# EAGLE design meduZa (EAGLE 6.1)
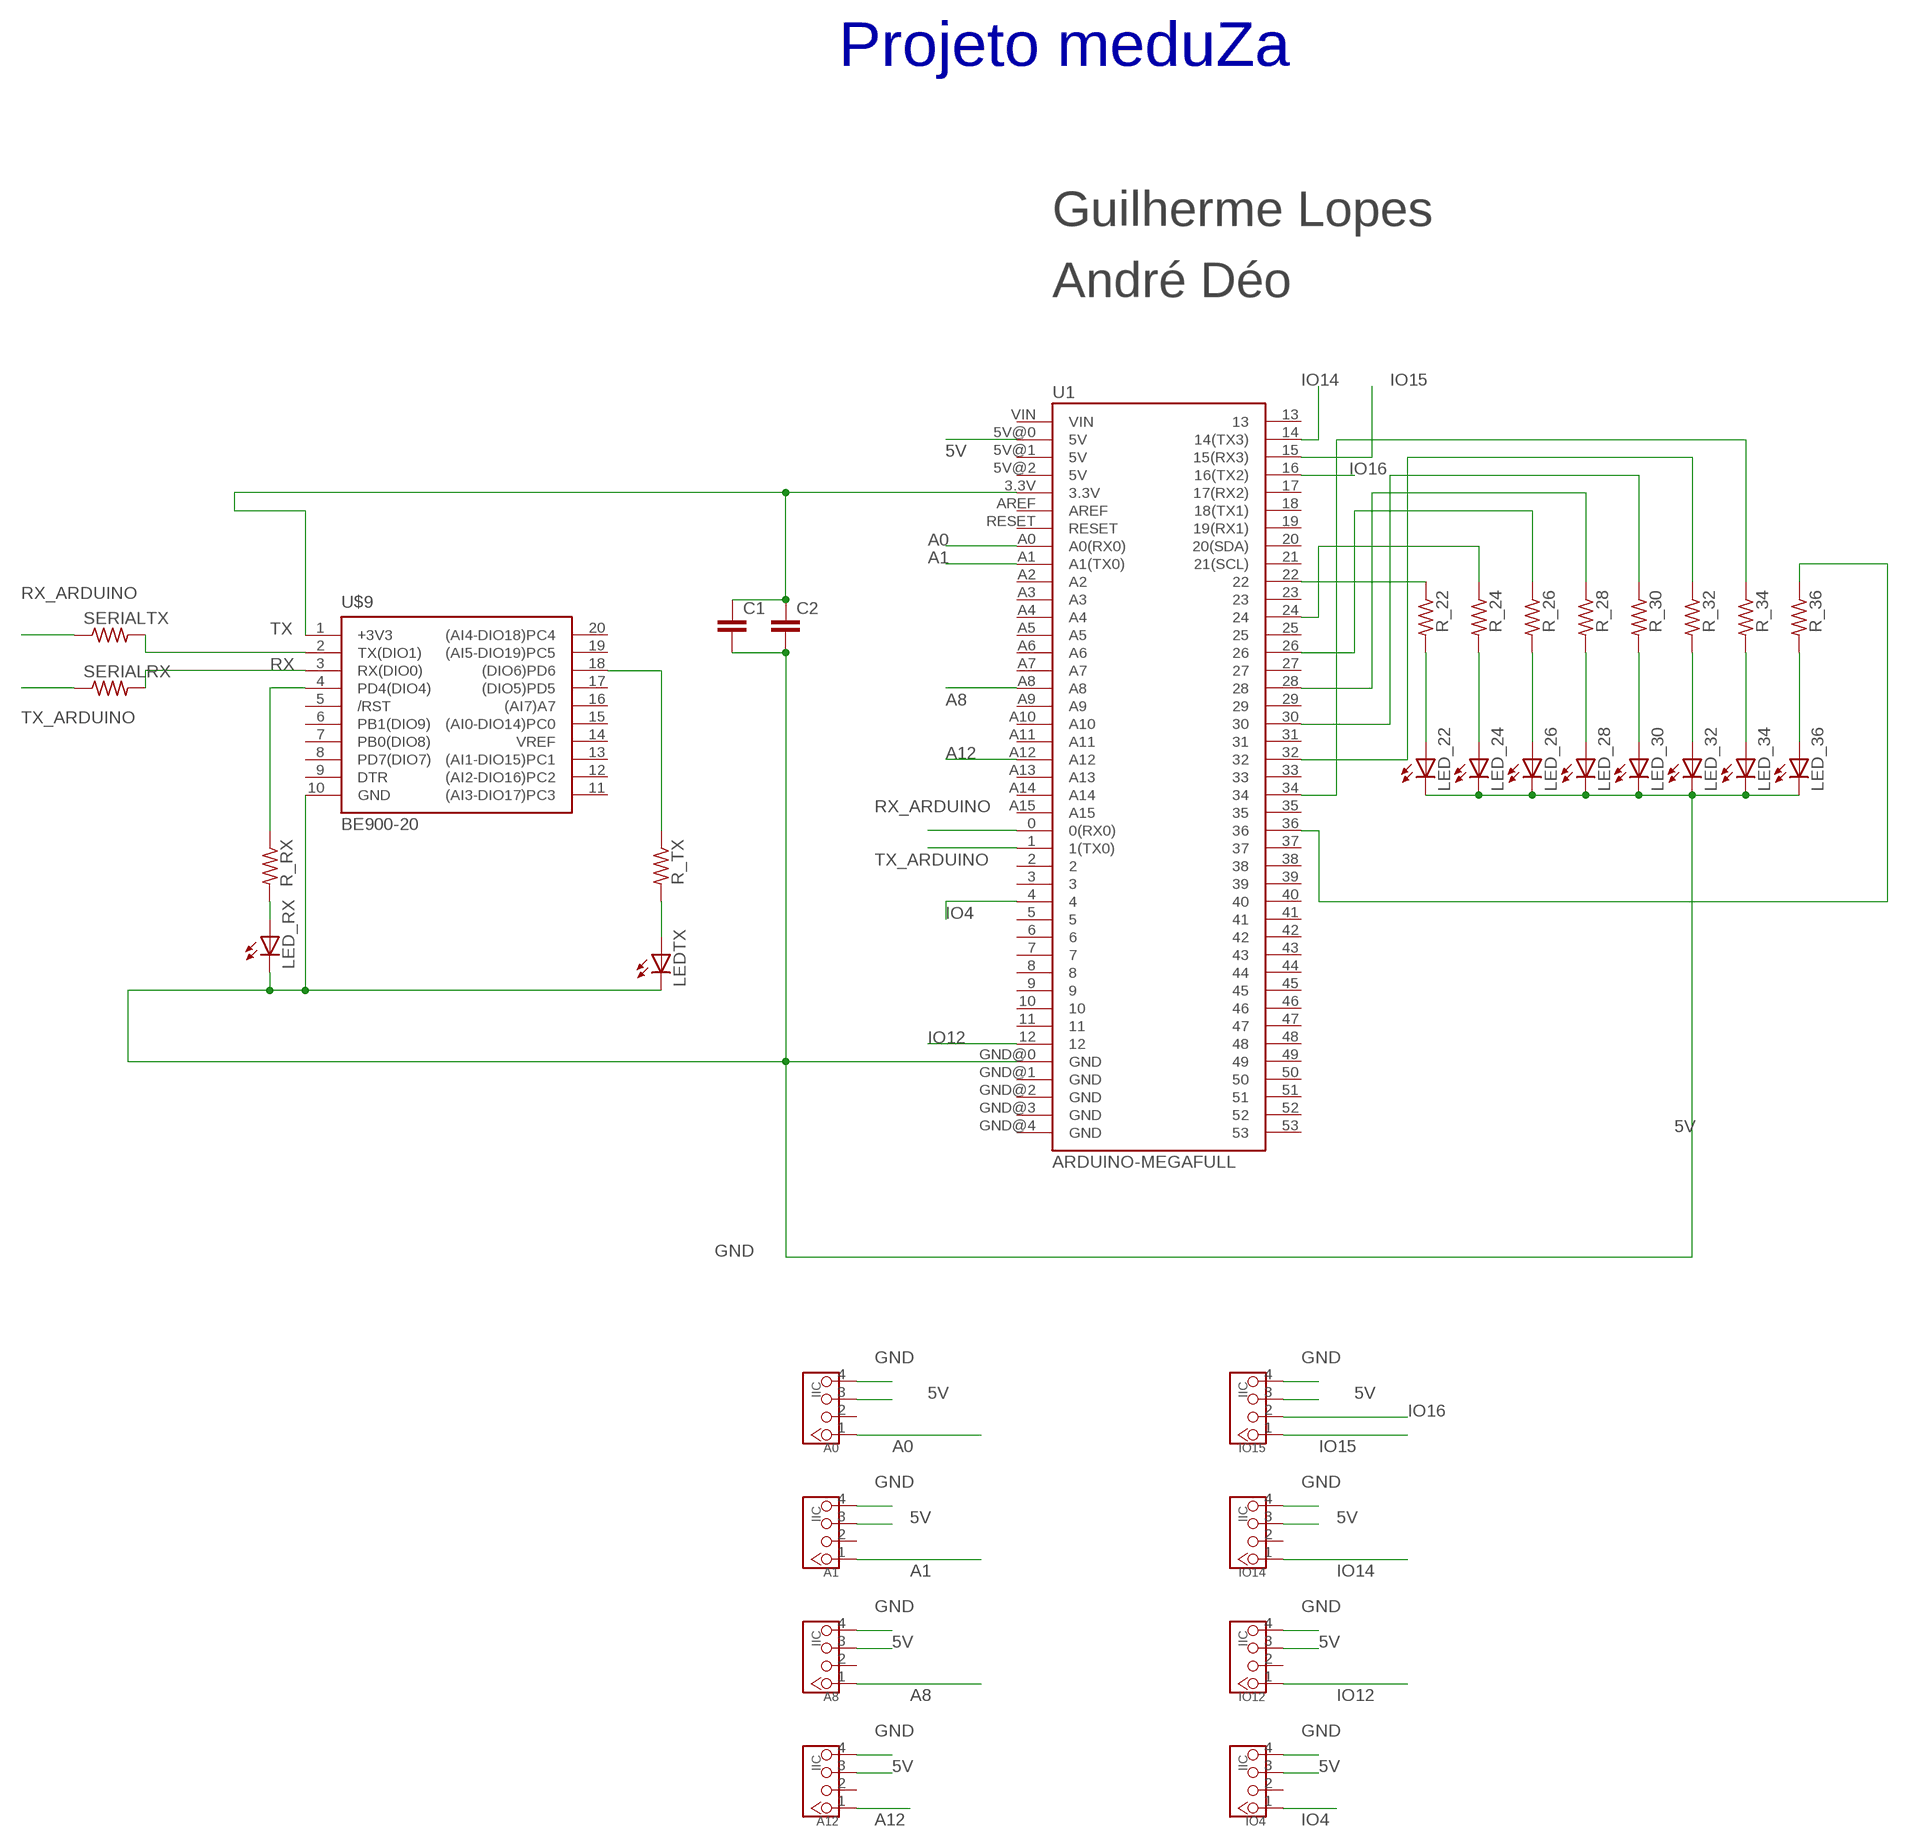
[diagram p0: schematic, sheet 1]

## Parts
A0  IIC  TWIG-4P-2.0-2.0  [4P-2.0]
A1  IIC  TWIG-4P-2.0-2.0  [4P-2.0]
A8  IIC  TWIG-4P-2.0-2.0  [4P-2.0]
A12  IIC  TWIG-4P-2.0-2.0  [4P-2.0]
C1  0.1UF-50V-20%(PTH)KIT-EZ  [CAP-PTH-SMALL-KIT]
C2  0.1UF-50V-20%(PTH)KIT-EZ  [CAP-PTH-SMALL-KIT]
IO4  IIC  TWIG-4P-2.0-2.0  [4P-2.0]
IO12  IIC  TWIG-4P-2.0-2.0  [4P-2.0]
IO14  IIC  TWIG-4P-2.0-2.0  [4P-2.0]
IO15  IIC  TWIG-4P-2.0-2.0  [4P-2.0]
LED_22  LED5MM  [LED5MM]
LED_24  LED5MM  [LED5MM]
LED_26  LED5MM  [LED5MM]
LED_28  LED5MM  [LED5MM]
LED_30  LED5MM  [LED5MM]
LED_32  LED5MM  [LED5MM]
LED_34  LED5MM  [LED5MM]
LED_36  LED5MM  [LED5MM]
LED_RX  LED5MM  [LED5MM]
LEDTX  LED5MM  [LED5MM]
R_22  R-US_0204/7  [0204/7]
R_24  R-US_0204/7  [0204/7]
R_26  R-US_0204/7  [0204/7]
R_28  R-US_0204/7  [0204/7]
R_30  R-US_0204/7  [0204/7]
R_32  R-US_0204/7  [0204/7]
R_34  R-US_0204/7  [0204/7]
R_36  R-US_0204/7  [0204/7]
R_RX  R-US_0204/7  [0204/7]
R_TX  R-US_0204/7  [0204/7]
SERIALRX  R-US_0204/7  [0204/7]
SERIALTX  R-US_0204/7  [0204/7]
U1  ARDUINO-MEGAFULL  [ARDUINO_MEGA]
U$9  BE900-20  [BE900_20]

## Nets
3V3: C1.1 C2.1 U1.3.3V U$9.1(+3V3)
5V: A0.3 A1.3 A8.3 A12.3 IO4.3 IO12.3 IO14.3 IO15.3 U1.5V@0(5V)
A0: A0.1 U1.A0(A0(RX0))
A1: A1.1 U1.A1(A1(TX0))
A8: A8.1 U1.A8
A12: A12.1 U1.A12
GND: A0.4 A1.4 A8.4 A12.4 C1.2 C2.2 IO4.4 IO12.4 IO14.4 IO15.4 LED_22.K(C) LED_24.K(C) LED_26.K(C) LED_28.K(C) LED_30.K(C) LED_32.K(C) LED_34.K(C) LED_36.K(C) LED_RX.K(C) LEDTX.K(C) U1.GND@0(GND) U$9.10(GND)
IO4: IO4.1 U1.4
IO12: IO12.1 U1.12
IO14: IO14.1 U1.14(14(TX3))
IO15: IO15.1 U1.15(15(RX3))
IO16: IO15.2 U1.16(16(TX2))
N$1: R_RX.1 U$9.4(PD4(DIO4))
N$2: R_TX.1 U$9.18((DIO6)PD6)
N$3: LED_22.A R_22.2
N$4: LED_24.A R_24.2
N$5: LED_RX.A R_RX.2
N$6: LEDTX.A R_TX.2
N$7: LED_26.A R_26.2
N$8: LED_28.A R_28.2
N$9: LED_30.A R_30.2
N$10: LED_32.A R_32.2
N$11: LED_34.A R_34.2
N$12: LED_36.A R_36.2
N$13: R_22.1 U1.22
N$14: R_24.1 U1.24
N$15: R_26.1 U1.26
N$16: R_28.1 U1.28
N$17: R_30.1 U1.30
N$18: R_32.1 U1.32
N$19: R_34.1 U1.34
N$20: R_36.1 U1.36
RX: SERIALRX.2 U$9.3(RX(DIO0))
RX_ARDUINO: SERIALTX.1 U1.0(0(RX0))
TX: SERIALTX.2 U$9.2(TX(DIO1))
TX_ARDUINO: SERIALRX.1 U1.1(1(TX0))
Unconnected: A0.2 A1.2 A8.2 A12.2 IO4.2 IO12.2 IO14.2 U1.2 U1.3 U1.5 U1.5V@1(5V) U1.5V@2(5V) U1.6 U1.7 U1.8 U1.9 U1.10 U1.11 U1.13 U1.17(17(RX2)) U1.18(18(TX1)) U1.19(19(RX1)) U1.20(20(SDA)) U1.21(21(SCL)) U1.23 U1.25 U1.27 U1.29 U1.31 U1.33 U1.35 U1.37 U1.38 U1.39 U1.40 U1.41 U1.42 U1.43 U1.44 U1.45 U1.46 U1.47 U1.48 U1.49 U1.50 U1.51 U1.52 U1.53 U1.A2 U1.A3 U1.A4 U1.A5 U1.A6 U1.A7 U1.A9 U1.A10 U1.A11 U1.A13 U1.A14 U1.A15 U1.AREF U1.GND@1(GND) U1.GND@2(GND) U1.GND@3(GND) U1.GND@4(GND) U1.RESET U1.VIN U$9.5(/RST) U$9.6(PB1(DIO9)) U$9.7(PB0(DIO8)) U$9.8(PD7(DIO7)) U$9.9(DTR) U$9.11((AI3-DIO17)PC3) U$9.12((AI2-DIO16)PC2) U$9.13((AI1-DIO15)PC1) U$9.14(VREF) U$9.15((AI0-DIO14)PC0) U$9.16((AI7)A7) U$9.17((DIO5)PD5) U$9.19((AI5-DIO19)PC5) U$9.20((AI4-DIO18)PC4)

## Notes on the sheet
- Projeto meduZa
- Guilherme Lopes
- André Déo

## Library data of the parts
A0 A1 A8 A12 IO4 IO12 IO14 IO15 = Connector:TWIG-4P-2.0
C1 C2 = SparkFun-Capacitors:0.1UF-50V-20%(PTH): CAP-08370; PROD_ID: CAP-08370
LED_22 LED_24 LED_26 LED_28 LED_30 LED_32 LED_34 LED_36 LED_RX LEDTX = adafruit:LED: LED OSRAM: - CHIPLED LG R971, LG N971, LY N971, LG Q971, LY Q971, LO R971, LY R971 LH N974, LH R974 LS Q976, LO Q976, LY Q976 LO Q996 - Hyper CHIPLED LW Q18S LB Q993, LB Q99A, LB R99A - SideLED LS A670, LO A670, LY A670, LG A670, LP A670 LB A673, LV A673, LT A673, LW A673 LH A674 LY A675 LS A676, LA A676, LO A676, LY A676, LW A676 LS A679, LY A679, LG A679 - Hyper Micro SIDELED® LS Y876, LA Y876, LO Y876, LY Y876 LT Y87S - SmartLED LW L88C, LW L88S LB L89C, LB L89S, LG L890 LS L89K, LO L89K, LY L89K LS L896, LA L896, LO L896, LY L896 - TOPLED LS T670, LO T670, LY T670, LG T670, LP T670 LSG T670, LSP T670, LSY T670, LOP T670, LYG T670 LG T671, LOG T671, LSG T671 LB T673, LV T673, LT T673, LW T673 LH T674 LS T676, LA T676, LO T676, LY T676, LB T676, LH T676, LSB T676, LW T676 LB T67C, LV T67C, LT T67C, LS T67K, LO T67K, LY T67K, LW E67C LS E67B, LA E67B, LO E67B, LY E67B, LB E67C, LV E67C, LT E67C LW T67C LS T679, LY T679, LG T679 LS T770, LO T770, LY T770, LG T770, LP T770 LB T773, LV T773, LT T773, LW T773 LH T774 LS E675, LA E675, LY E675, LS T675 LS T776, LA T776, LO T776, LY T776, LB T776 LHGB T686 LT T68C, LB T68C - Hyper Mini TOPLED® LB M676 - Mini TOPLED Santana® LG M470 LS M47K, LO M47K, LY M47K Source: http://www.osram.convergy.de/
R_22 R_24 R_26 R_28 R_30 R_32 R_34 R_36 R_RX R_TX SERIALRX SERIALTX = resistor:R-US_: RESISTOR, American symbol
U1 = SparkFun-Boards:ARDUINO-MEGA: Arduino Mega board footprint
U$9 = SpreadCom_F:BE900

## Board
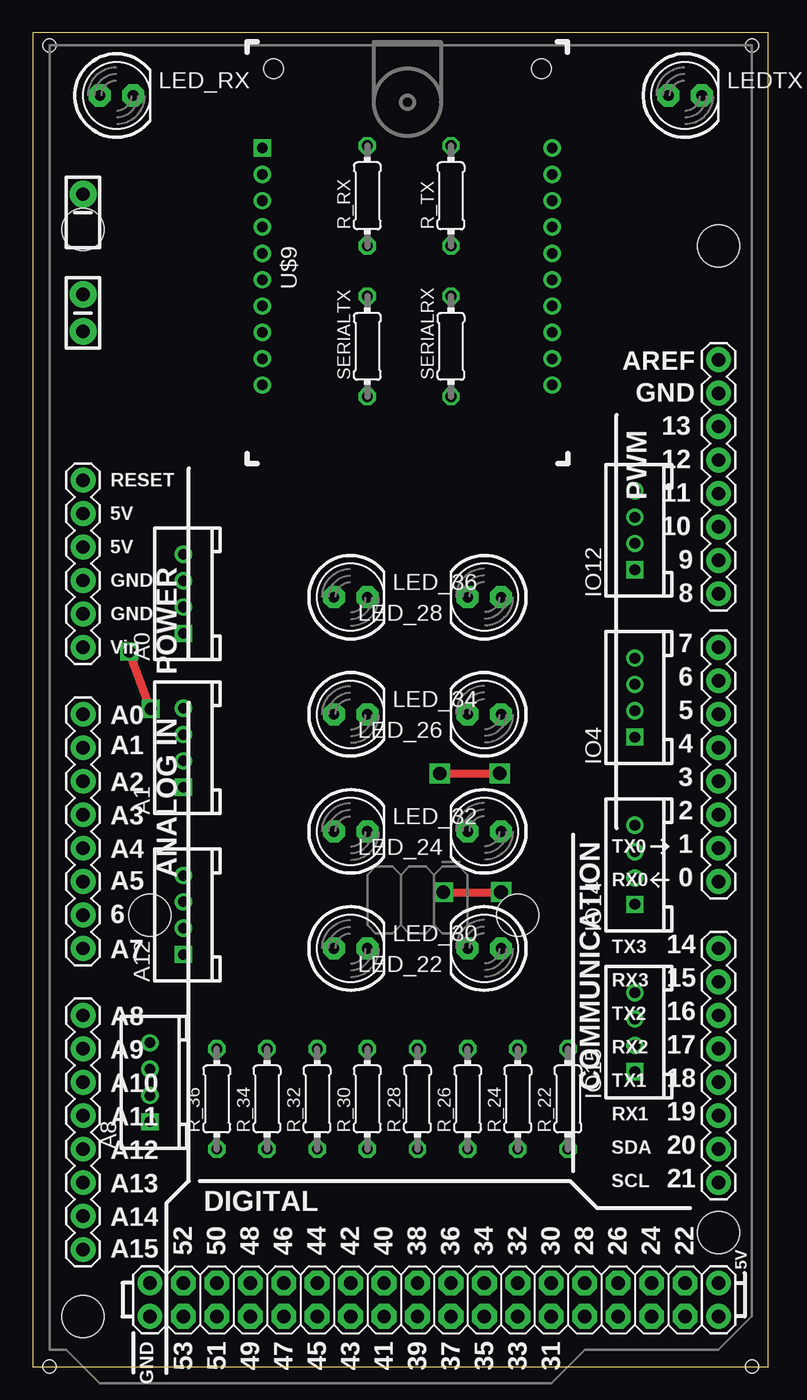
[diagram p1: board, top side]
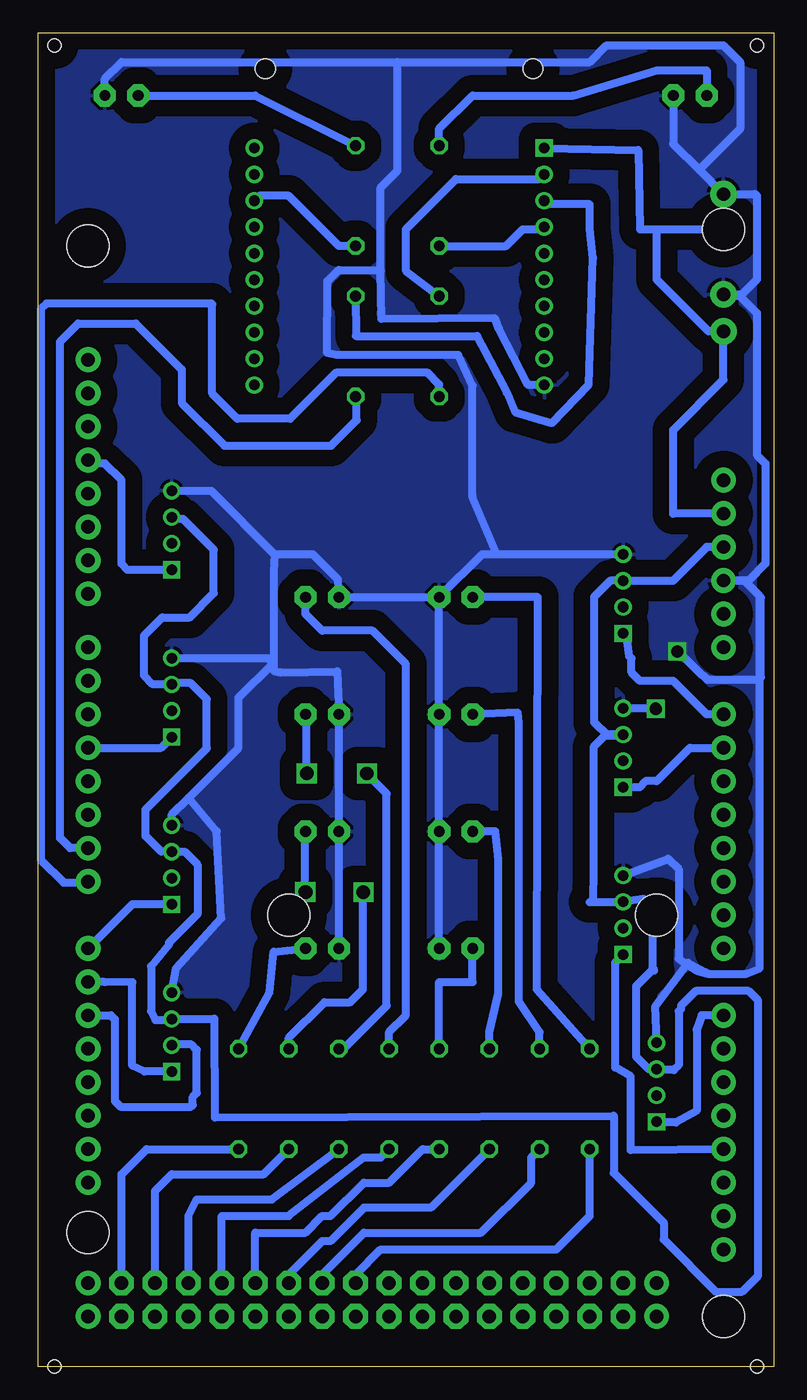
[diagram p2: board, bottom side, seen from below]

Size 55.86 x 101.27 mm. Coordinates in mm from the lower left corner, seen from the top.
Outline: 0,0 55.86,0 55.86,101.27 0,101.27 0,0
Copper layers (1*16): Top 0.035mm / dielectric 1.5mm / Bottom 0.035mm
Design rules: minimum track width 10mil, minimum drill 24mil, track to track 8mil, track to pad 8mil, pad to pad 8mil, via to via 8mil, smd to smd 8mil, copper to edge 40mil, drill to drill 8mil, minimum pad ring 10mil, minimum via ring 8mil, stop-mask expansion 4mil, vias tented up to drill 0mil, thermal gap 10mil
Holes 1 mm at 1.27,100.33 54.61,100.33 54.61,0 1.27,0

### Footprints (pad centres in the part's own frame; a part is rotated, then mirrored left to right if it is on the bottom)
4P-2.0 = drill 0.8 pad 1.27 square: 1 -3,0 | drill 0.8 pad 1.27: 2 -1,0; 3 1,0; 4 3,0
CAP-PTH-SMALL-KIT = drill 1.016 pad 2.032: 1 -1.397,0; 2 1.397,0
LED5MM = drill 0.813 pad 1.676 octagon: A -1.27,0; K 1.27,0
0204/7 = drill 0.813 octagon: 1 -3.81,0; 2 3.81,0
ARDUINO_MEGA = drill 1.016 pad 1.88: 0 63.5,50.8; 1 60.96,50.8; 2 58.42,50.8; 3 55.88,50.8; 3.3V 35.56,2.54; 4 53.34,50.8; 5 50.8,50.8; 5V@0 38.1,2.54; 5V@1 93.98,50.8; 5V@2 96.52,50.8; 6 48.26,50.8; 7 45.72,50.8; 8 41.656,50.8; 9 39.116,50.8; 10 36.576,50.8; 11 34.036,50.8; 12 31.496,50.8; 13 28.956,50.8; 14 68.58,50.8; 15 71.12,50.8; 16 73.66,50.8; 17 76.2,50.8; 18 78.74,50.8; 19 81.28,50.8; 20 83.82,50.8; 21 86.36,50.8; A0 50.8,2.54; A1 53.34,2.54; A2 55.88,2.54; A3 58.42,2.54; A4 60.96,2.54; A5 63.5,2.54; A6 66.04,2.54; A7 68.58,2.54; A8 73.66,2.54; A9 76.2,2.54; A10 78.74,2.54; A11 81.28,2.54; A12 83.82,2.54; A13 86.36,2.54; A14 88.9,2.54; A15 91.44,2.54; AREF 23.876,50.8; GND@0 40.64,2.54; GND@1 43.18,2.54; GND@2 93.98,7.62; GND@3 96.52,7.62; GND@4 26.416,50.8; RESET 33.02,2.54; VIN 45.72,2.54 | drill 1.016 pad 1.88 octagon: 22 93.98,48.26; 23 96.52,48.26; 24 93.98,45.72; 25 96.52,45.72; 26 93.98,43.18; 27 96.52,43.18; 28 93.98,40.64; 29 96.52,40.64; 30 93.98,38.1; 31 96.52,38.1; 32 93.98,35.56; 33 96.52,35.56; 34 93.98,33.02; 35 96.52,33.02; 36 93.98,30.48; 37 96.52,30.48; 38 93.98,27.94; 39 96.52,27.94; 40 93.98,25.4; 41 96.52,25.4; 42 93.98,22.86; 43 96.52,22.86; 44 93.98,20.32; 45 96.52,20.32; 46 93.98,17.78; 47 96.52,17.78; 48 93.98,15.24; 49 96.52,15.24; 50 93.98,12.7; 51 96.52,12.7; 52 93.98,10.16; 53 96.52,10.16 | hole 3.2: 15.24,50.8; 13.97,2.54; 66.04,35.56; 66.04,7.62; 90.17,50.8; 96.52,2.54
BE900_20 = drill 0.8 pad 1.3 square: 1 23.952,23.216 | drill 0.8 pad 1.3: 2 21.952,23.216; 3 19.952,23.216; 4 17.952,23.216; 5 15.952,23.216; 6 13.952,23.216; 7 11.952,23.216; 8 9.952,23.216; 9 7.952,23.216; 10 5.952,23.216; 11 5.952,1.194; 12 7.952,1.194; 13 9.952,1.194; 14 11.952,1.194; 15 13.952,1.194; 16 15.952,1.194; 17 17.952,1.194; 18 19.952,1.194; 19 21.952,1.194; 20 23.952,1.194 | hole 1.5: 29.972,22.352; 29.972,2.032

### Placement (x,y rotation side)
A0  11.43,58.67 90 top
A1  11.43,46.99 90 top
A8  8.89,21.59 90 top
A12  11.43,34.29 90 top
C1  3.81,87.63 90 top
C2  3.81,80.01 90 top
IO4  45.72,50.8 90 top
IO12  45.72,63.5 90 top
IO14  45.72,38.1 90 top
IO15  45.72,25.4 90 top
LED_22  34.29,31.75 180 top
LED_24  34.29,40.64 180 top
LED_26  34.29,49.53 180 top
LED_28  34.29,58.42 180 top
LED_30  24.13,31.75 0 top
LED_32  24.13,40.64 0 top
LED_34  24.13,49.53 0 top
LED_36  24.13,58.42 0 top
LED_RX  6.35,96.52 0 top
LEDTX  49.53,96.52 0 top
R_22  40.64,20.32 90 top
R_24  36.83,20.32 90 top
R_26  33.02,20.32 90 top
R_28  29.21,20.32 90 top
R_30  25.4,20.32 90 top
R_32  21.59,20.32 90 top
R_34  17.78,20.32 90 top
R_36  13.97,20.32 90 top
R_RX  25.4,88.9 90 top
R_TX  31.75,88.9 90 top
SERIALRX  31.75,77.47 90 top
SERIALTX  25.4,77.47 90 top
U1  1.27,100.33 270 top
U$9  40.64,68.58 90 top

### Tracks (layer width: path | path; a pad name or v marks a point on that pad's centre or on a via)
3V3
  Bottom 0.61: U$9.1 10.29,92.38 10.16,86.36 8.89,86.36 | 8.89,86.36 3.94,86.36 C1.1 | U1.3.3V 7.62,64.77 7.62,71.12 3.81,74.93 C2.1 4.95,78.61 8.89,82.55 8.89,86.36
5V
  Bottom 0.61: U1.5V@0 5.08,62.23 7.64,59.67 A0.3 12.41,59.67 13.64,58.45 13.64,48.95 12.6,47.9 11.52,47.9 A1.3 12.74,47.99 13.69,47.04 13.69,37.79 13.72,35.28 13.98,35.28 A12.3 9.94,35.51 9.85,35.51 9.17,34.82 9.17,30.18 | A8.3 9.48,22.59 9.55,22.66 | 10.41,23.52 10.44,23.55 10.44,28.91 9.17,30.18 | IO12.3 45.58,64.36 44.86,64.36 42.52,62.03 42.52,58.72 44.35,56.9 46.43,56.9 47.83,55.5 47.83,52.48 47.15,51.8 IO4.3 45.72,52.07 45.74,52.04 45.74,51.74 45.8,51.69 45.8,51.66 45.57,51.89 44.27,51.89 43.05,50.67 43.05,46.94 47.7,42.29 47.7,40.28 46.52,39.1 IO14.3 44.74,39.1 43.76,38.12 43.76,34.37 45.92,32.21 45.92,32.05 47.29,30.4 47.29,26.98 46.96,26.31 45.81,26.31 IO15.3 44.18,26.4 42.49,26.42 42.44,18.92 12.17,19.05 12.14,19.03 12.14,14.71 8.36,10.92 8.36,9.65 4.39,5.69 2.39,5.69 1.17,6.91 1.17,27.79 1.9,28.52 5.92,28.52 7.04,27.41 7.04,27.15 7.21,26.98 7.21,22.89 7.57,22.53 8.81,22.53 8.94,22.66 9.55,22.66 | 9.55,22.66 10.41,23.52 | 10.41,23.52 10.41,28.91 9.17,30.15 | 9.17,30.15 9.17,30.18 | 9.17,30.18 9.12,30.23 9.2,30.23 9.25,30.18 9.17,30.18 | 9.17,30.18 9.09,30.1 9.09,30.05 9.14,30.1 9.2,30.1 9.17,30.12 9.17,30.15
A0
  Bottom 0.61: A0.1 11.22,55.88 10.97,53.95 10.79,53.77 10.79,52.7 10.16,52.07 7.62,52.07 5.08,49.53 U1.A0
A1
  Bottom 0.61: A1.1 10.18,43.99 9.73,44.45 8.89,44.45 6.35,46.99 U1.A1
A8
  Bottom 0.61: U1.A8 5.46,26.67 5.84,25.6 5.84,19.43 7.42,18.54 8.74,18.54 8.79,18.59 | 8.79,18.59 8.81,18.62 8.86,18.62 A8.1 | A8.1 8.91,18.57 8.91,18.44 8.97,18.39 8.97,18.62 8.91,18.62 A8.1 | A8.1 8.79,18.59
A12
  Bottom 0.61: U1.A12 10.85,16.43 10.85,22.02 12.04,22.71 12.04,30.68 A12.1
GND  (via drill 0.9)
  Top 0.61: v8.94,49.91 v7.31,54.3
  Bottom 0.61: LED_22.K LED_24.K LED_26.K 33.15,52.78 37.46,52.7 37.97,52.83 37.97,53.34 | LED_RX.K 7.62,92.84 5.65,90.87 | 5.65,90.87 C1.2 1.4,89.03 1.27,88.9 1.27,82.55 2.54,81.28 3.68,81.28 C2.2 2.67,81.41 1.27,80.01 1.27,69.22 0.63,68.58 0.63,60.96 1.9,59.69 2.26,59.69 | 2.26,59.69 U1.GND@0 3.81,59.61 3.78,59.64 2.21,59.64 | 37.9,61.67 35,61.67 33.1,59.77 LED_28.K LED_36.K | 37.9,61.67 37.97,60.38 37.97,53.34 | LEDTX.K 50.8,97.79 49.53,99.06 28.57,99.06 | 28.57,99.06 13.97,99.06 12.7,100.33 3.81,100.33 2.54,99.06 2.54,93.98 5.65,90.87 | U$9.10 18.65,74.53 20.85,78.79 21.18,79.6 29.79,79.55 29.84,83.21 | 29.84,83.21 29.84,89.54 28.57,90.81 28.57,99.06 | LED_36.K 22.15,61.67 A0.4 21.03,61.67 22.86,66.04 22.86,74.5 23.95,76.81 33.17,76.81 33.91,76.96 33.88,82.42 33.04,83.26 29.9,83.26 29.84,83.21 | A12.4 8,38.56 7.21,37.77 7.21,30.96 5.79,30.05 4.95,29.82 | 4.95,29.82 2.08,29.82 1.07,30.25 1.07,58.5 | 1.07,58.5 2.21,59.64 | 2.21,59.64 2.26,59.69 | A1.4 8.97,49.99 v8.94,49.91 | v7.31,54.3 7.47,54.53 5.46,52.53 5.38,52.5 5.05,52.17 1.12,52.17 0.96,52.32 0.96,58.39 1.07,58.5 | A8.4 8.97,27.38 6.5,30.66 5.16,29.95 4.95,29.82 | IO12.4 42.73,66.5 37.9,61.67 | IO4.4 38.43,53.8 38.04,53.4 | 38.04,53.4 37.97,53.34 | IO14.4 45.72,41.91 44.45,43.18 | 44.45,43.18 40.64,46.99 40.64,50.8 38.04,53.4 | IO15.4 45.39,30.23 41.96,34.04 42.29,40.64 44.45,43.18 | LED_36.K LED_34.K LED_32.K LED_30.K
  pour Bottom (isolate 1.27): 0.63,100.97 56.13,100.69 55.24,0.64 0,0.64 0,100.97
IO4
  Bottom 0.61: U1.4 46.53,46.99 IO4.1
IO12
  Bottom 0.61: IO12.1 49.07,60.5 49.53,60.96 49.53,67.31 50.8,68.58 51.82,68.58 U1.12
IO14
  Bottom 0.61: IO14.1 48.72,35.1 U1.14
IO15
  Bottom 0.61: IO15.1 47.8,22.4 48.72,22.84 48.72,29.18 50.8,29.21 U1.15
IO16
  Bottom 0.61: U1.16 50.34,26.67 50.04,26.37 50.04,20.17 49.61,19.74 44.25,19.74 44.12,19.86 44.12,20.47 43.81,20.78 43.81,24.05 44.22,24.46 45.64,24.46 45.7,24.41 | 45.7,24.41 IO15.2 45.74,24.38 | IO15.2 45.7,24.4 45.7,24.41
N$1
  Bottom 0.61: R_RX.1 20.32,85.09 19.05,86.36 17.6,86.36 U$9.4
N$2
  Bottom 0.61: R_TX.1 33.02,85.09 36.83,88.9 39.08,88.9 U$9.18
N$3
  Bottom 0.61: R_22.2 38.3,28.4 37.97,31.5 LED_22.A
N$4  (via drill 1)
  Top 0.61: v31.14,36.02 v35.54,36.02 35.56,36.02 v35.59,36.04
  Bottom 0.61: R_24.2 36.83,24.94 34.11,27.66 32.16,27.66 31.19,28.63 31.19,35.97 v31.14,36.02 | v35.59,36.04 35.59,40.61 LED_24.A
N$5
  Bottom 0.61: R_RX.2 25.4,93.98 22.86,96.52 15.24,96.52 8.89,98.42 5.08,98.42 LED_RX.A
N$6
  Bottom 0.61: LEDTX.A 39.37,96.52 R_TX.2
N$7  (via drill 1)
  Top 0.61: v30.91,45.03 v35.48,45.03
  Bottom 0.61: R_26.2 32.66,24.13 29.39,27.41 29.39,43.51 v30.91,45.03 | v35.48,45.03 35.48,49.45 LED_26.A
N$8
  Bottom 0.61: R_28.2 29.21,25.4 27.94,26.67 27.94,53.34 30.48,55.88 34.29,55.88 35.56,57.15 LED_28.A
N$9
  Bottom 0.61: R_30.2 25.4,29.21 22.86,29.21 LED_30.A
N$10
  Bottom 0.61: R_32.2 21.59,25.4 20.9,28.35 20.9,38.51 21.13,40.64 LED_32.A
N$11
  Bottom 0.61: R_34.2 17.78,25.4 19.35,27.74 19.35,48.89 19.43,49.66 LED_34.A
N$12
  Bottom 0.61: R_36.2 17.98,28.65 17.91,58.42 LED_36.A
N$13
  Bottom 0.61: U1.22 49.53,14.61 47.62,16.51 R_22.1
N$14
  Bottom 0.61: U1.24 46.99,13.34 45.72,14.61 38.73,14.61 R_24.1
N$15
  Bottom 0.61: U1.26 44.45,11.43 43.81,12.7 38.1,12.7 R_26.1
N$16
  Bottom 0.61: U1.28 41.91,11.43 36.83,11.43 31.12,15.88 29.84,15.88 R_28.1
N$17
  Bottom 0.61: U1.30 39.37,10.16 35.56,10.16 34.29,11.43 33.65,11.43 31.12,13.97 29.21,13.97 26.67,16.51 R_30.1
N$18
  Bottom 0.61: R_32.1 26.03,12.07 31.12,12.07 33.65,9.53 34.29,9.53 36.83,6.99 U1.32
N$19
  Bottom 0.61: U1.34 34.29,6.99 31.12,10.16 22.22,10.16 18.41,13.97 18.41,15.88 R_34.1
N$20
  Bottom 0.61: U1.36 31.75,6.99 29.84,8.89 16.51,8.89 13.97,11.43 R_36.1
N$21  (via drill 0.9)
  other vias: 8.97,49.96
N$22  (via drill 1)
  other vias: 30.89,45.03
N$23  (via drill 1)
  other vias: 35.43,45.06
N$24  (via drill 1)
  other vias: 31.17,36.02
RX
  Bottom 0.61: SERIALRX.2 31.73,78.26 22.53,78.26 20.27,73.94 19.63,72.49 16.84,71.65 14.05,74.57 13.72,84.2 13.97,86.36 13.97,88.27 17.16,88.27 U$9.3
RX_ARDUINO
  Bottom 0.61: SERIALTX.1 25.4,74.57 26.29,75.46 33.25,75.46 36.73,71.98 40.74,71.98 42.65,73.89 42.65,80.65 42.72,80.72 55.22,80.72 55.65,80.29 55.65,38.48 53.92,36.75 52.15,36.75 U1.0
TX
  Bottom 0.61: SERIALTX.2 27.91,83.19 27.94,86.36 24.13,90.17 17.78,90.17 U$9.2 | U$9.2 17.14,90.81 17.78,90.81 | U$9.2
TX_ARDUINO
  Bottom 0.61: U1.1 53.44,39.37 54.2,40.13 54.2,77.83 52.83,79.2 48.44,79.2 44.96,75.72 44.96,73.18 41.71,69.93 33.6,69.93 31.67,71.86 31.67,73.58 SERIALRX.1